# EAGLE design HW2CHONG (EAGLE 7.5.0)
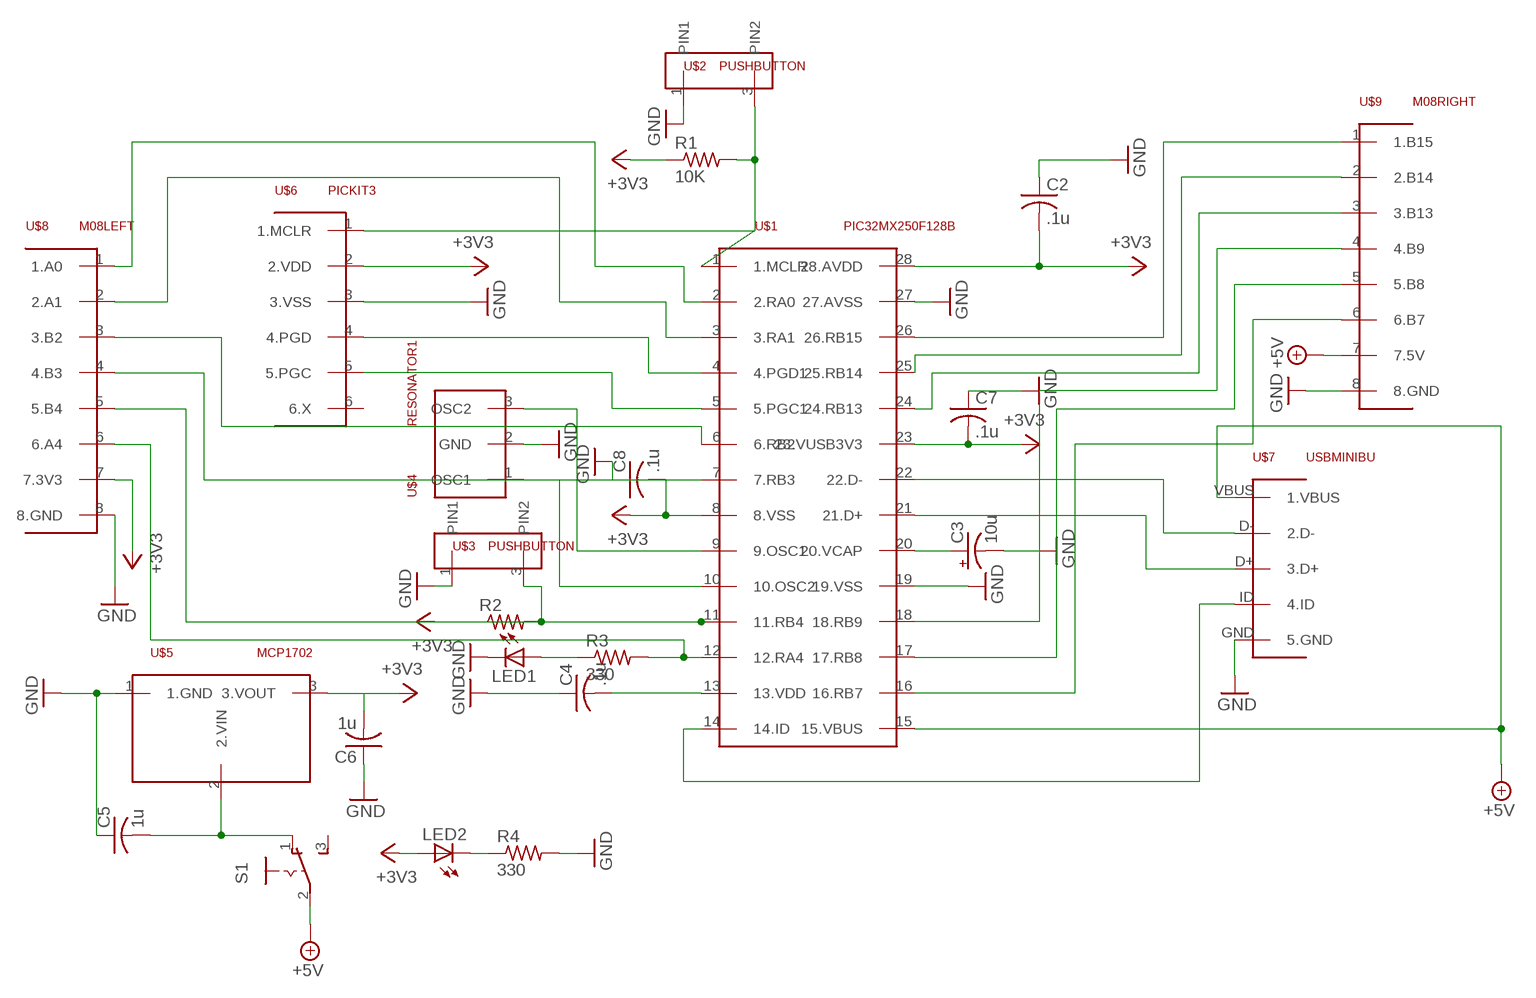
[diagram p0: schematic, sheet 1]

## Parts
C2  .1u  C-US025-025X050  [C025-025X050]
C3  10u  CPOL-USB45181A  [B45181A]
C4  .1u  C-US025-025X050  [C025-025X050]
C5  1u  C-US025-025X050  [C025-025X050]
C6  1u  C-US025-025X050  [C025-025X050]
C7  .1u  C-US025-025X050  [C025-025X050]
C8  .1u  C-US025-025X050  [C025-025X050]
LED1  LED3MM  [LED3MM]
LED2  LED3MM  [LED3MM]
R1  10K  R-US_0207/10  [0207/10]
R2  R-US_0207/10  [0207/10]
R3  330  R-US_0207/10  [0207/10]
R4  330  R-US_0207/10  [0207/10]
S1  255SB  [255SB]
U$1  PIC32MX250F128B  [DIL28-3]
U$2  PUSHBUTTON  [1X03]
U$3  PUSHBUTTON  [1X03]
U$4  RESONATOR1  [1X03]
U$5  MCP1702  [TO92]
U$6  PICKIT3  [1X06]
U$7  USBMINIBU  [USB-MB-H]
U$8  M08LEFT  [1X08]
U$9  M08RIGHT  [1X08]

## Nets
+3V3: C2.2 C7.2 C8.2 LED2.A R1.1 R2.1 U$1.8(8.VSS) U$1.23(23.VUSB3V3) U$1.28(28.AVDD) U$6.2(2.VDD) U$8.7(7.3V3)
+5V: S1.2(P) U$1.15(15.VBUS) U$7.VBUS(1.VBUS) U$9.7(7.5V)
GND: C2.1 C3.- C4.1 C5.1 C6.1 C7.1 C8.1 LED1.K(C) R4.2 U$1.19(19.VSS) U$1.27(27.AVSS) U$2.1(PIN1) U$3.1(PIN1) U$4.2(GND) U$5.1(1.GND) U$6.3(3.VSS) U$7.GND(5.GND) U$8.8(8.GND) U$9.8(8.GND)
N$1: LED1.A R3.1
N$2: R3.2 U$1.12(12.RA4) U$8.6(6.A4)
N$3: R1.2 U$1.1(1.MCLR) U$2.3(PIN2) U$6.1(1.MCLR)
N$4: C3.+ U$1.20(20.VCAP)
N$5: R2.2 U$1.11(11.RB4) U$3.3(PIN2) U$8.5(5.B4)
N$6: C4.2 U$1.13(13.VDD)
N$7: C6.2 U$5.3(3.VOUT)
N$8: U$1.10(10.OSC2) U$4.1(OSC1)
N$9: U$1.9(9.OSC1) U$4.3(OSC2)
N$10: U$1.4(4.PGD1) U$6.4(4.PGD)
N$11: U$1.5(5.PGC1) U$6.5(5.PGC)
N$12: U$1.22(22.D-) U$7.D-(2.D-)
N$13: U$1.21(21.D+) U$7.D+(3.D+)
N$14: U$1.14(14.ID) U$7.ID(4.ID)
N$15: U$1.2(2.RA0) U$8.1(1.A0)
N$16: C5.2 S1.1(O) U$5.2(2.VIN)
N$17: LED2.K(C) R4.1
N$18: U$1.3(3.RA1) U$8.2(2.A1)
N$19: U$1.6(6.RB2) U$8.3(3.B2)
N$20: U$1.7(7.RB3) U$8.4(4.B3)
N$25: U$1.26(26.RB15) U$9.1(1.B15)
N$26: U$1.25(25.RB14) U$9.2(2.B14)
N$27: U$1.24(24.RB13) U$9.3(3.B13)
N$28: U$1.18(18.RB9) U$9.4(4.B9)
N$29: U$1.17(17.RB8) U$9.5(5.B8)
N$30: U$1.16(16.RB7) U$9.6(6.B7)
Unconnected: S1.3(S) U$6.6(6.X)

## Library data of the parts
C2 C4-C8 = HW2LIBRARY:C-US: CAPACITOR, American symbol
C3 = HW2LIBRARY:CPOL-US: POLARIZED CAPACITOR, American symbol
LED1 LED2 = HW2LIBRARY:LED: LED OSRAM: - CHIPLED LG R971, LG N971, LY N971, LG Q971, LY Q971, LO R971, LY R971 LH N974, LH R974 LS Q976, LO Q976, LY Q976 LO Q996 - Hyper CHIPLED LW Q18S LB Q993, LB Q99A, LB R99A - SideLED LS A670, LO A670, LY A670, LG A670, LP A670 LB A673, LV A673, LT A673, LW A673 LH A674 LY A675 LS A676, LA A676, LO A676, LY A676, LW A676 LS A679, LY A679, LG A679 - Hyper Micro SIDELED® LS Y876, LA Y876, LO Y876, LY Y876 LT Y87S - SmartLED LW L88C, LW L88S LB L89C, LB L89S, LG L890 LS L89K, LO L89K, LY L89K LS L896, LA L896, LO L896, LY L896 - TOPLED LS T670, LO T670, LY T670, LG T670, LP T670 LSG T670, LSP T670, LSY T670, LOP T670, LYG T670 LG T671, LOG T671, LSG T671 LB T673, LV T673, LT T673, LW T673 LH T674 LS T676, LA T676, LO T676, LY T676, LB T676, LH T676, LSB T676, LW T676 LB T67C, LV T67C, LT T67C, LS T67K, LO T67K, LY T67K, LW E67C LS E67B, LA E67B, LO E67B, LY E67B, LB E67C, LV E67C, LT E67C LW T67C LS T679, LY T679, LG T679 LS T770, LO T770, LY T770, LG T770, LP T770 LB T773, LV T773, LT T773, LW T773 LH T774 LS E675, LA E675, LY E675, LS T675 LS T776, LA T776, LO T776, LY T776, LB T776 LHGB T686 LT T68C, LB T68C - Hyper Mini TOPLED® LB M676 - Mini TOPLED Santana® LG M470 LS M47K, LO M47K, LY M47K Source: http://www.osram.convergy.de LUXEON: - LUMILED® LXK2-PW12-R00, LXK2-PW12-S00, LXK2-PW14-U00, LXK2-PW14-V00 LXK2-PM12-R00, LXK2-PM12-S00, LXK2-PM14-U00 LXK2-PE12-Q00, LXK2-PE12-R00, LXK2-PE12-S00, LXK2-PE14-T00, LXK2-PE14-U00 LXK2-PB12-K00, LXK2-PB12-L00, LXK2-PB12-M00, LXK2-PB14-N00, LXK2-PB14-P00, LXK2-PB14-Q00 LXK2-PR12-L00, LXK2-PR12-M00, LXK2-PR14-Q00, LXK2-PR14-R00 LXK2-PD12-Q00, LXK2-PD12-R00, LXK2-PD12-S00 LXK2-PH12-R00, LXK2-PH12-S00 LXK2-PL12-P00, LXK2-PL12-Q00, LXK2-PL12-R00 Source: www.luxeon.com KINGBRIGHT: KA-3528ASYC Source: www.kingbright.com
R1-R4 = HW2LIBRARY:R-US_: RESISTOR, American symbol
S1 = HW2LIBRARY:255SB: SLIDING SWITCH Distributor Buerklin, 11G810
U$1 = HW2LIBRARY:PIC32MX250F128B
U$2 U$3 = HW2LIBRARY:PUSHBUTTON
U$4 = HW2LIBRARY:RESONATOR
U$5 = HW2LIBRARY:MCP1702
U$6 = HW2LIBRARY:PICKIT3
U$7 = HW2LIBRARY:USBMINIB
U$8 = HW2LIBRARY:M08LEFT
U$9 = HW2LIBRARY:M08RIGHT

## Board
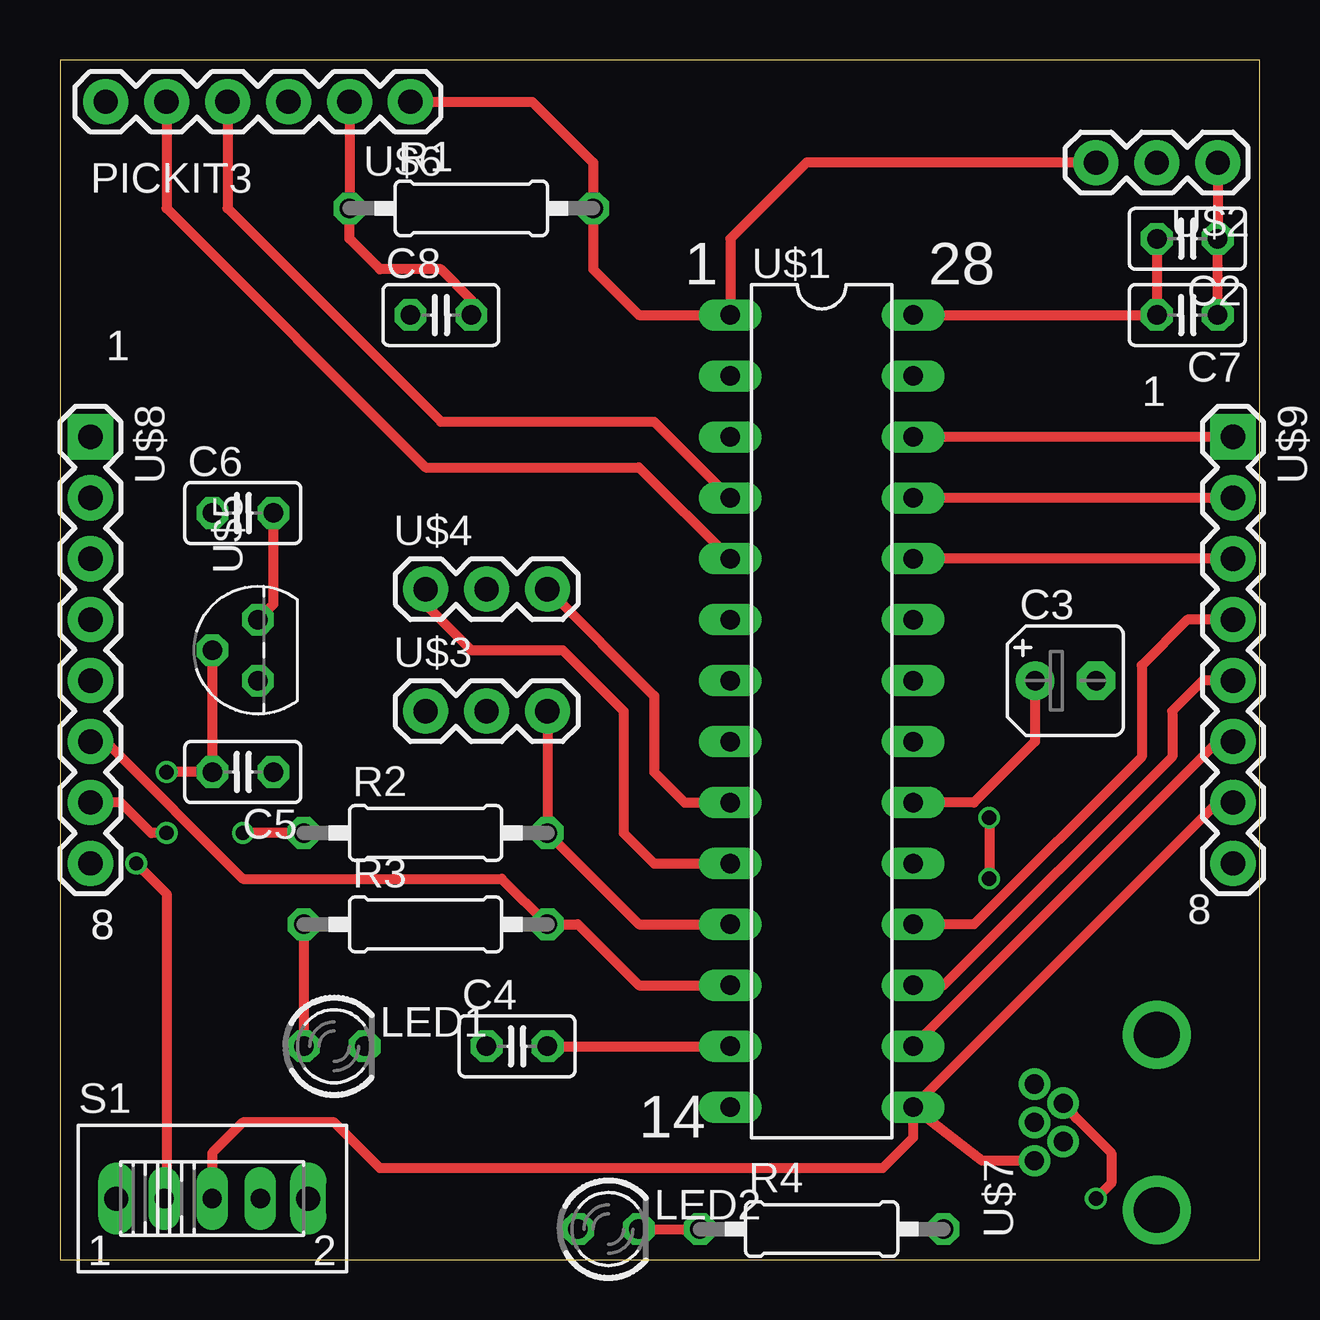
[diagram p1: board, top side]
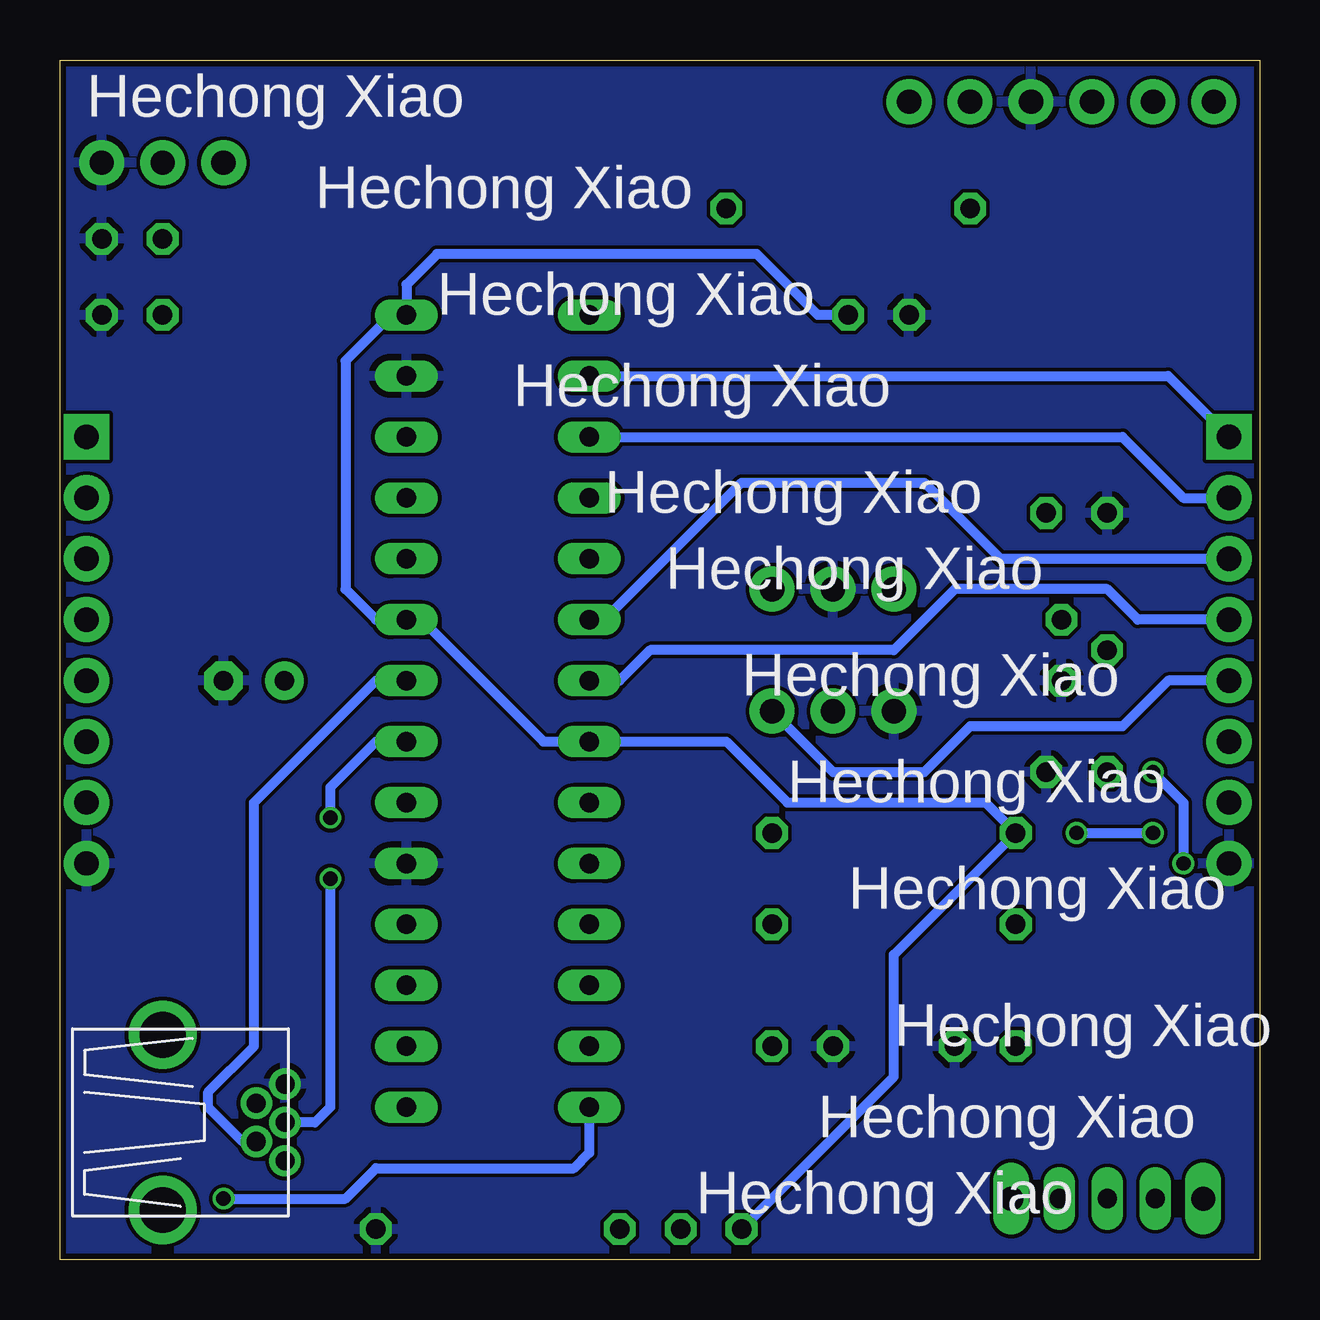
[diagram p2: board, bottom side, seen from below]

Size 50 x 50 mm. Coordinates in mm from the lower left corner, seen from the top.
Outline: 0,0 50,0 50,50 0,50 0,0
Copper layers (1*16): Top 0.035mm / dielectric 1.5mm / Bottom 0.035mm
Design rules "SeeedStudio_2layer_DRU_no_angle_20140221": minimum track width 6mil, minimum drill 12mil, track to track 6mil, track to pad 6mil, pad to pad 6mil, via to via 6mil, smd to smd 0mil, copper to edge 10mil, drill to drill 10mil, minimum pad ring 10mil, minimum via ring 6mil, stop-mask expansion 2mil, vias tented up to drill 100mil, thermal gap 10mil

### Footprints (pad centres in the part's own frame; a part is rotated, then mirrored left to right if it is on the bottom)
C025-025X050 = drill 0.813 octagon: 1 -1.27,0; 2 1.27,0
B45181A = drill 0.813 pad 1.6: + -1.27,0 | drill 0.813 pad 1.6 octagon: - 1.27,0
LED3MM = drill 0.813 octagon: A -1.27,0; K 1.27,0
0207/10 = drill 0.813 octagon: 1 -5.08,0; 2 5.08,0
255SB = drill 0.8 long: 1 -2,0; 2 0,0; 3 2,0 | drill 1 long: P$1 -4,0; P$2 4,0
DIL28-3 = drill 0.813 long: 1 -16.51,-3.81; 2 -13.97,-3.81; 3 -11.43,-3.81; 4 -8.89,-3.81; 5 -6.35,-3.81; 6 -3.81,-3.81; 7 -1.27,-3.81; 8 1.27,-3.81; 9 3.81,-3.81; 10 6.35,-3.81; 11 8.89,-3.81; 12 11.43,-3.81; 13 13.97,-3.81; 14 16.51,-3.81; 15 16.51,3.81; 16 13.97,3.81; 17 11.43,3.81; 18 8.89,3.81; 19 6.35,3.81; 20 3.81,3.81; 21 1.27,3.81; 22 -1.27,3.81; 23 -3.81,3.81; 24 -6.35,3.81; 25 -8.89,3.81; 26 -11.43,3.81; 27 -13.97,3.81; 28 -16.51,3.81
1X03 = drill 1.016 pad 1.88: 1 0,0; 2 2.54,0; 3 5.08,0
TO92 = drill 0.813 octagon: 1 -1.27,0; 2 0,1.905; 3 1.27,0
1X06 = drill 1.016 pad 1.88: 1 0,0; 2 2.54,0; 3 5.08,0; 4 7.62,0; 5 10.16,0; 6 12.7,0
USB-MB-H = drill 0.8: D+ 5.1,0; D- 3.9,0.8; GND 5.1,-1.6; ID 3.9,-0.8; VBUS 5.1,1.6 | drill 1.9: P$6 0,-3.65; P$7 0,3.65
1X08 = drill 1.016 pad 1.88 square: 1 0,0 | drill 1.016 pad 1.88: 2 2.54,0; 3 5.08,0; 4 7.62,0; 5 10.16,0; 6 12.7,0; 7 15.24,0; 8 17.78,0

### Placement (x,y rotation side)
C2  46.99,42.55 180 top
C3  41.91,24.13 0 top
C4  19.05,8.89 0 top
C5  7.62,20.32 180 top
C6  7.62,31.11 0 top
C7  46.99,39.37 180 top
C8  15.88,39.37 0 top
LED1  11.43,8.89 0 top
LED2  22.86,1.27 0 top
R1  17.14,43.81 0 top
R2  15.24,17.78 0 top
R3  15.24,13.97 0 top
R4  31.75,1.27 0 top
S1  6.35,2.54 0 top
U$1  31.75,22.86 270 top
U$2  48.26,45.72 180 top
U$3  15.24,22.86 0 top
U$4  15.24,27.94 0 top
U$5  8.26,25.4 90 top
U$6  14.61,48.26 180 top
U$7  45.72,5.71 180 top
U$8  1.27,34.29 270 top
U$9  48.9,34.29 270 top

### Tracks (layer width: path | path; a pad name or v marks a point on that pad's centre or on a via)
+3V3  (via drill 0.6)
  Top 0.406: C2.2 C7.2 U$1.28 | U$6.2 R1.1 12.06,42.55 13.34,41.27 15.88,41.27 17.14,40.01 C8.2 | R2.1 v7.62,17.78 | v4.45,17.78 3.81,17.78 2.54,19.05 U$8.7
  Bottom 0.406: v7.62,17.78 v4.45,17.78 | LED2.A 15.24,7.62 15.24,12.7 R2.1 11.43,19.05 19.68,19.05 22.23,21.59 U$1.8 29.84,21.59 34.92,26.67 U$1.23 36.83,26.67 38.1,27.94 38.1,37.47 36.2,39.37 U$1.28 35.56,40.64 34.29,41.91 20.95,41.91 18.41,39.37 C8.2
+5V
  Top 0.406: U$1.15 35.56,5.08 34.29,3.81 13.34,3.81 11.43,5.71 7.62,5.71 6.35,4.45 S1.2 | U$7.VBUS 38.43,4.12 U$1.15 | U$9.7 48.26,19.05 U$1.15
GND
  Top 0.406: U$2.1 C2.1 C7.1
  pour Bottom: 50.8,0 50.8,49.53 50.8,50.8 0,50.8 0,0
N$1
  Top 0.406: R3.1 LED1.A
N$2
  Top 0.406: U$1.12 24.13,11.43 21.59,13.97 R3.2 18.41,15.88 7.62,15.88 1.91,21.59 U$8.6
N$3
  Top 0.406: U$2.3 31.11,45.72 27.94,42.55 U$1.1 24.13,39.37 22.23,41.27 R1.2 22.23,45.72 19.68,48.26 U$6.1
N$4
  Top 0.406: 35.66,19.16 U$1.20 38.1,19.05 40.64,21.59 C3.+
N$5
  Top 0.406: U$1.11 24.13,13.97 R2.2 U$3.3
  Bottom 0.406: U$8.5 3.81,24.13 5.71,22.23 12.06,22.23 13.97,20.32 17.78,20.32 U$3.3
N$6
  Top 0.406: C4.2 U$1.13
N$7
  Top 0.406: C6.2 8.89,27.3 U$5.3
N$8
  Top 0.406: U$4.1 15.24,27.3 17.14,25.4 20.95,25.4 23.5,22.86 23.5,17.78 24.77,16.51 U$1.10
N$9
  Top 0.406: U$4.3 24.77,23.5 24.77,20.32 26.04,19.05 U$1.9
N$10
  Top 0.406: U$6.4 6.99,43.81 15.88,34.92 24.77,34.92 U$1.4
N$11
  Top 0.406: U$6.5 4.45,43.81 15.24,33.02 24.13,33.02 U$1.5
N$12
  Bottom 0.406: U$7.D- 42.38,4.92 43.81,6.35 43.81,6.99 41.91,8.89 41.91,19.05 36.83,24.13 U$1.22
N$13  (via drill 0.6)
  Top 0.406: v38.73,18.41 v38.73,15.88
  Bottom 0.406: U$1.21 36.83,21.59 38.73,19.68 v38.73,18.41 | v38.73,15.88 38.73,6.35 39.37,5.71 U$7.D+
N$14  (via drill 0.6)
  Top 0.406: U$7.ID 42.38,5.88 43.81,4.45 43.81,3.17 v43.18,2.54
  Bottom 0.406: v43.18,2.54 38.1,2.54 36.83,3.81 28.57,3.81 27.94,4.45 U$1.14
N$15
  Bottom 0.406: U$1.2 3.81,36.83 U$8.1
N$16  (via drill 0.6)
  Top 0.406: U$5.2 C5.2 v4.45,20.32 | v3.17,16.51 4.45,15.24 4.45,2.63 S1.1
  Bottom 0.406: v4.45,20.32 3.17,19.05 v3.17,16.51
N$17
  Top 0.406: LED2.K R4.1
N$18
  Bottom 0.406: U$1.3 5.71,34.29 3.17,31.75 U$8.2
N$19
  Bottom 0.406: U$1.6 27.3,26.67 21.59,32.38 13.97,32.38 10.79,29.21 U$8.3
N$20
  Bottom 0.406: U$8.4 5.08,26.67 6.35,27.94 12.7,27.94 15.24,25.4 25.4,25.4 26.67,24.13 U$1.7
N$25
  Top 0.406: U$9.1 U$1.26
N$26
  Top 0.406: U$9.2 U$1.25
N$27
  Top 0.406: U$9.3 U$1.24
N$28
  Top 0.406: U$9.4 46.99,26.67 45.09,24.77 45.09,20.95 38.1,13.97 U$1.18
N$29
  Top 0.406: U$9.5 47.62,24.13 46.35,22.86 46.35,20.95 36.83,11.43 U$1.17
N$30
  Top 0.406: U$9.6 48.26,21.59 U$1.16

### Text on the board
tPlace: PICKIT3 | 1 | 28 | 1 | 1 | 8 | 8 | 8 | 14
bPlace: Hechong Xiao | Hechong Xiao | Hechong Xiao | Hechong Xiao | Hechong Xiao | Hechong Xiao | Hechong Xiao | Hechong Xiao | Hechong Xiao | Hechong Xiao | Hechong Xiao | Hechong Xiao